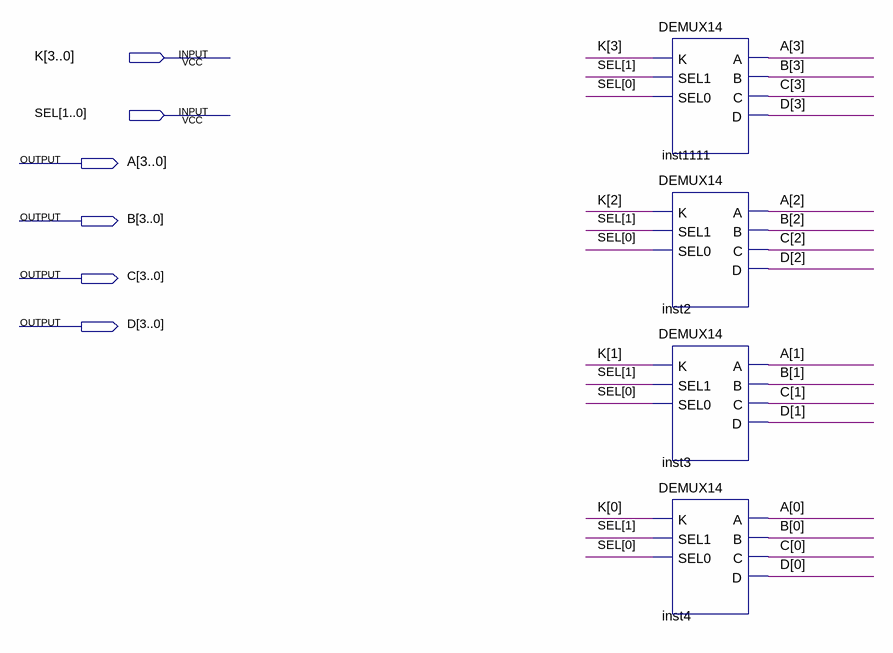
[diagram p0: schematic sheet]
// Quartus schematic DEMUX14_4BITS.bdf as structural Verilog: 4 symbols, 6 pins
module DEMUX14_4BITS (
  input  [3:0] K,
  input  [1:0] SEL,
  output [3:0] A,
  output [3:0] B,
  output [3:0] C,
  output [3:0] D
);

  DEMUX14 inst1111 (.K(K[3]), .SEL1(SEL[1]), .SEL0(SEL[0]), .A(A[3]), .B(B[3]), .C(C[3]), .D(D[3]));
  DEMUX14 inst2 (.K(K[2]), .SEL1(SEL[1]), .SEL0(SEL[0]), .A(A[2]), .B(B[2]), .C(C[2]), .D(D[2]));
  DEMUX14 inst3 (.K(K[1]), .SEL1(SEL[1]), .SEL0(SEL[0]), .A(A[1]), .B(B[1]), .C(C[1]), .D(D[1]));
  DEMUX14 inst4 (.K(K[0]), .SEL1(SEL[1]), .SEL0(SEL[0]), .A(A[0]), .B(B[0]), .C(C[0]), .D(D[0]));
endmodule
